# Altium schematic sheet NucleoSheet.SchDoc
size A; SheetNumber: 6; SheetTotal: 6
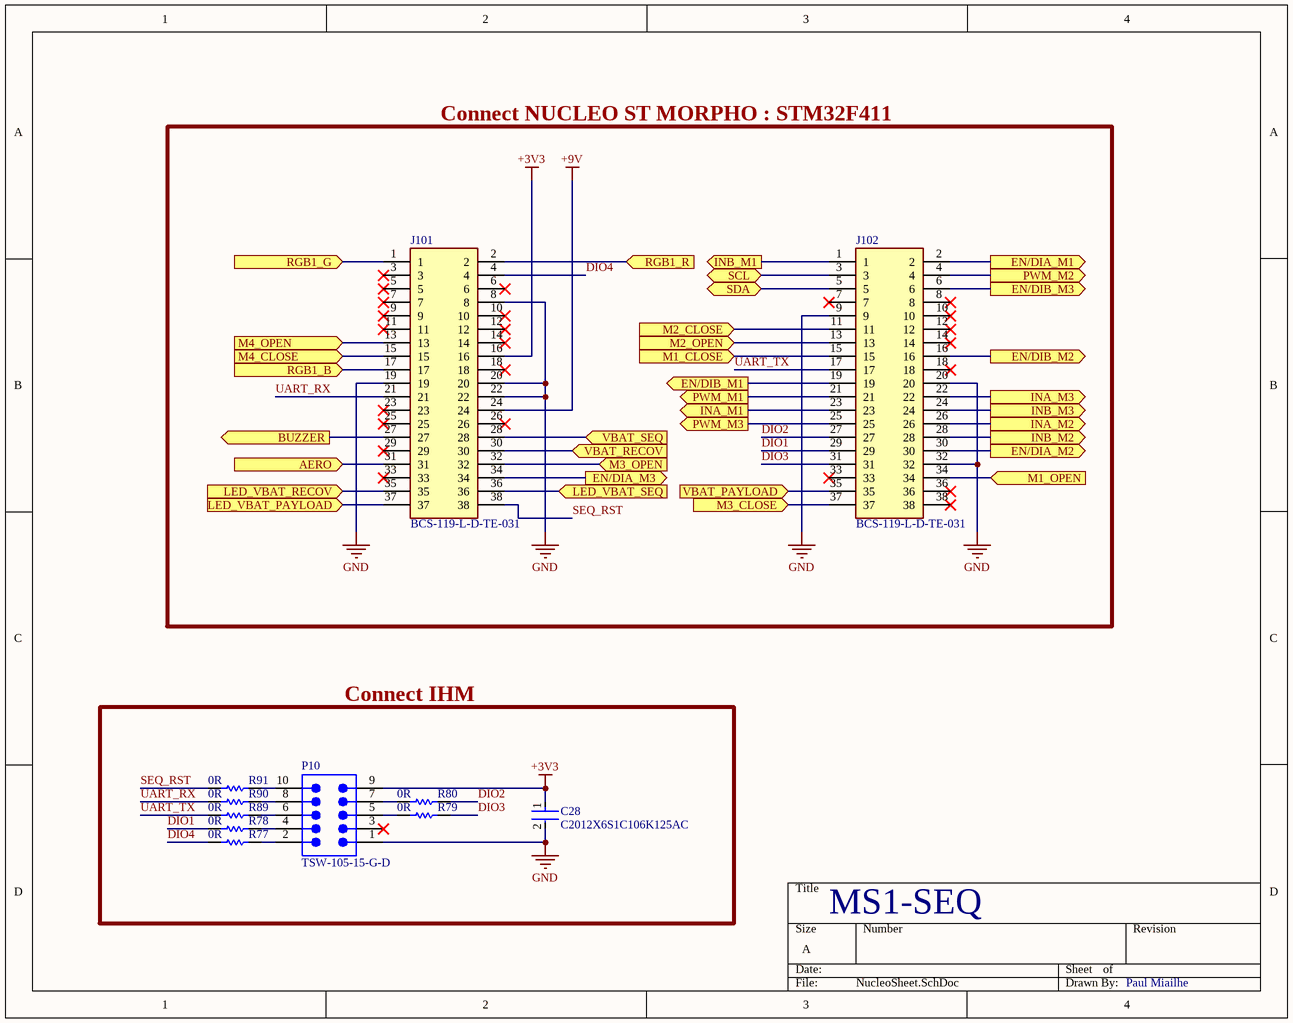
[diagram p0: NucleoSheet.SchDoc]

## Parts
C28  C2012X6S1C106K125AC  [FP-C2012-125-0_2-MFG]
J101  BCS-119-L-D-TE-031  [RHDR38W51P254_2X19_4826X508X737P]
J102  BCS-119-L-D-TE-031  [RHDR38W51P254_2X19_4826X508X737P]
P10  TSW-105-15-G-D  [SMTC-TSW-105-15-X-D]
R77  Resistor: 0R  [RESC1609X50X30NL8T20]  (hidden comment: CRCW06030000Z0EA)
R78  Resistor: 0R  [RESC1609X50X30NL8T20]  (hidden comment: CRCW06030000Z0EA)
R79  Resistor: 0R  [RESC1609X50X30NL8T20]  (hidden comment: CRCW06030000Z0EA)
R80  Resistor: 0R  [RESC1609X50X30NL8T20]  (hidden comment: CRCW06030000Z0EA)
R89  Resistor: 0R  [RESC1609X50X30NL8T20]  (hidden comment: CRCW06030000Z0EA)
R90  Resistor: 0R  [RESC1609X50X30NL8T20]  (hidden comment: CRCW06030000Z0EA)
R91  Resistor: 0R  [RESC1609X50X30NL8T20]  (hidden comment: CRCW06030000Z0EA)

## Blocks framed on the sheet
Connect NUCLEO ST MORPHO : STM32F411: J101 J102
Connect IHM: C28 P10 R77-R80 R89-R91

## Ports
AERO (in), BUZZER (out), EN/DIA_M1 (out), EN/DIA_M2 (out), EN/DIA_M3 (out), EN/DIB_M1 (out), EN/DIB_M2 (out), EN/DIB_M3 (out), INA_M1 (out), INA_M2 (out), INA_M3 (out), INB_M1 (out), INB_M2 (out), INB_M3 (out), LED_VBAT_PAYLOAD (in), LED_VBAT_RECOV (in), LED_VBAT_SEQ (in), M1_CLOSE (in), M1_OPEN (in), M2_CLOSE (in), M2_OPEN (in), M3_CLOSE (in), M3_OPEN (in), M4_CLOSE (in), M4_OPEN (in), PWM_M1 (out), PWM_M2 (out), PWM_M3 (out), RGB1_B (in), RGB1_G (in), RGB1_R (in), SCL (bidir), SDA (bidir), VBAT_PAYLOAD (in), VBAT_RECOV (in), VBAT_SEQ (in)

## Nets
+3V3: C28.1 J101.16 P10.9
+9V: J101.24
GND: C28.2 J101.8 J101.19 J101.20 J101.22 J102.9 J102.20 J102.32 P10.1
AERO: J101.31 ; port AERO
BUZZER: J101.27 ; port BUZZER
DIO1: J102.29 R78.1
DIO2: J102.27 R80.2
DIO3: J102.31 R79.2
DIO4: J101.4 R77.1
EN/DIA_M1: J102.2 ; port EN/DIA_M1
EN/DIA_M2: J102.30 ; port EN/DIA_M2
EN/DIA_M3: J101.34 ; port EN/DIA_M3
EN/DIB_M1: J102.19 ; port EN/DIB_M1
EN/DIB_M2: J102.16 ; port EN/DIB_M2
EN/DIB_M3: J102.6 ; port EN/DIB_M3
INA_M1: J102.23 ; port INA_M1
INA_M2: J102.26 ; port INA_M2
INA_M3: J102.22 ; port INA_M3
INB_M1: J102.1 ; port INB_M1
INB_M2: J102.28 ; port INB_M2
INB_M3: J102.24 ; port INB_M3
LED_VBAT_PAYLOAD: J101.37 ; port LED_VBAT_PAYLOAD
LED_VBAT_RECOV: J101.35 ; port LED_VBAT_RECOV
LED_VBAT_SEQ: J101.36 ; port LED_VBAT_SEQ
M1_CLOSE: J102.15 ; port M1_CLOSE
M1_OPEN: J102.34 ; port M1_OPEN
M2_CLOSE: J102.11 ; port M2_CLOSE
M2_OPEN: J102.13 ; port M2_OPEN
M3_CLOSE: J102.37 ; port M3_CLOSE
M3_OPEN: J101.32 ; port M3_OPEN
M4_CLOSE: J101.15 ; port M4_CLOSE
M4_OPEN: J101.13 ; port M4_OPEN
PWM_M1: J102.21 ; port PWM_M1
PWM_M2: J102.4 ; port PWM_M2
PWM_M3: J102.25 ; port PWM_M3
RGB1_B: J101.17 ; port RGB1_B
RGB1_G: J101.1 ; port RGB1_G
RGB1_R: J101.2 ; port RGB1_R
SCL: J102.3 ; port SCL
SDA: J102.5 ; port SDA
SEQ_RST: J101.38 R91.1
UART_RX: J101.21 R90.1
UART_TX: J102.17 R89.1
VBAT_PAYLOAD: J102.35 ; port VBAT_PAYLOAD
VBAT_RECOV: J101.30 ; port VBAT_RECOV
VBAT_SEQ: J101.28 ; port VBAT_SEQ
NetP10_2: P10.2 R77.2
NetP10_4: P10.4 R78.2
NetP10_5: P10.5 R79.1
NetP10_6: P10.6 R89.2
NetP10_7: P10.7 R80.1
NetP10_8: P10.8 R90.2
NetP10_10: P10.10 R91.2

Not connected (* = marked no-connect by the designer): J101 3* 5* 6* 7* 9* 10* 11* 12* 14* 18* 23* 25* 26* 29* 33*; J102 7* 8* 10* 12* 14* 18* 33* 36* 38*; P10 3*

## Notes on the sheet
- MS1-SEQ
- Paul Miailhe

## Library data of the parts
C28 = CMP-08246-003655-1: Multilayer Ceramic Capacitors 10μF ±10% 16V X6S SMD 0805; Capacitance: 10uF; Contact Plating: Tin; Height: 1.25mm; Thickness: 0.057inch; Case Code (Metric): 2012; Dielectric Material: Ceramic; Tolerance: 10%; Depth: 1.25mm; Length: 2mm; Lead Free: Lead Free; RoHS Compliant: Yes; Case/Package: 0805; REACH SVHC: No SVHC; Construction: Flat; Voltage Rating: 16V; Max Operating Temperature: 105°C; Series: C; Width: 0.049inch; Voltage Rating (DC): 16V; Packaging: Tape and Reel; Package Quantity: 1; Min Operating Temperature: -55°C; Mount: Surface Mount; Dielectric: X6S; Case Code (Imperial): 0805
J101 J102 = BCS-119-L-D-TE-031: Connector; Manufacturer_Name: SAMTEC; Datasheet Link: https://www.mouser.de/datasheet/2/527/bcs-1316906.pdf; Height: 7.37mm; Manufacturer_Part_Number: BCS-119-L-D-TE-031; Mouser Part Number: N/A; Mouser Price/Stock: https://www.mouser.co.uk/ProductDetail/Samtec/BCS-119-L-D-TE-031?qs=PZi7%2FduGOzQePdTvRHH2MQ%3D%3D
P10 = CMP-1024-00369-1: 0.025" SQ Post Header, Through-hole, Vertical, -55 to 125 degC, 2.54 mm Pitch, 10-Pin, Male, RoHS; Manufacturer: Samtec; Pitch: 2.54 mm; ComponentLink2Description: Datasheet; ComponentLink1URL: http://www.samtec.com; DatasheetVersion: F-214; ComponentLink3Description: Package Specification; PartNumber: TSW-105-15-G-D; RoHS: True; Temperature Range: -55 to 125 degC; ComponentLink3URL: http://www.samtec.com/documents/webfiles/cpdf/TSW-XXX-XX-XXX-X-XX-XXX-MKT.pdf; Orientation: Vertical; Mounting Technology: Through-hole; PackageReference: TSW-105-15-X-D; PackageVersion: DM, 8/1988; PackageDescription: .025[0.64] SQ. Post Terminal Strip Assembly; ComponentLink2URL: http://www.samtec.com/documents/webfiles/pdf/TSW_TH.PDF; ComponentLink1Description: Manufacturer URL
R77-R80 R89-R91 = CMP-2000-03816-5: Chip Resistor, 0 Ohm, Jumper, 100 mW, -55 to 155 degC, 0603 (1608 Metric), RoHS, Tape and Reel; Manufacturer: Vishay Semiconductor; Voltage Rating: 75 V; Package Quantity: 5000; DatasheetVersion: 06/2012; Min Operating Temperature: -55 degC; ComponentLink1URL: http://www.vishay.com/; Mounting Technology: Surface Mount; Height: 0.45 mm; ComponentLink1Description: Manufacturer URL; REACH SVHC: Unknown; Packaging: Tape and Reel; Max Operating Temperature: 155 degC; Mount: Surface Mount; ComponentLink2Description: Datasheet; PackageDescription: 2-Pin Surface Mount Device, Body 1.575 x 0.85 mm; Length: 1.55 mm; ComponentLink2URL: http://www.vishay.com/docs/20035/dcrcwe3.pdf; Pins: 2; RoHSCompliant: true